# Altium schematic sheet Real Time Clock.SchDoc: Real Time Clock
size OrCAD A; DocumentNumber: LM-003; Revision: 3.0; SheetNumber: 8; SheetTotal: 11
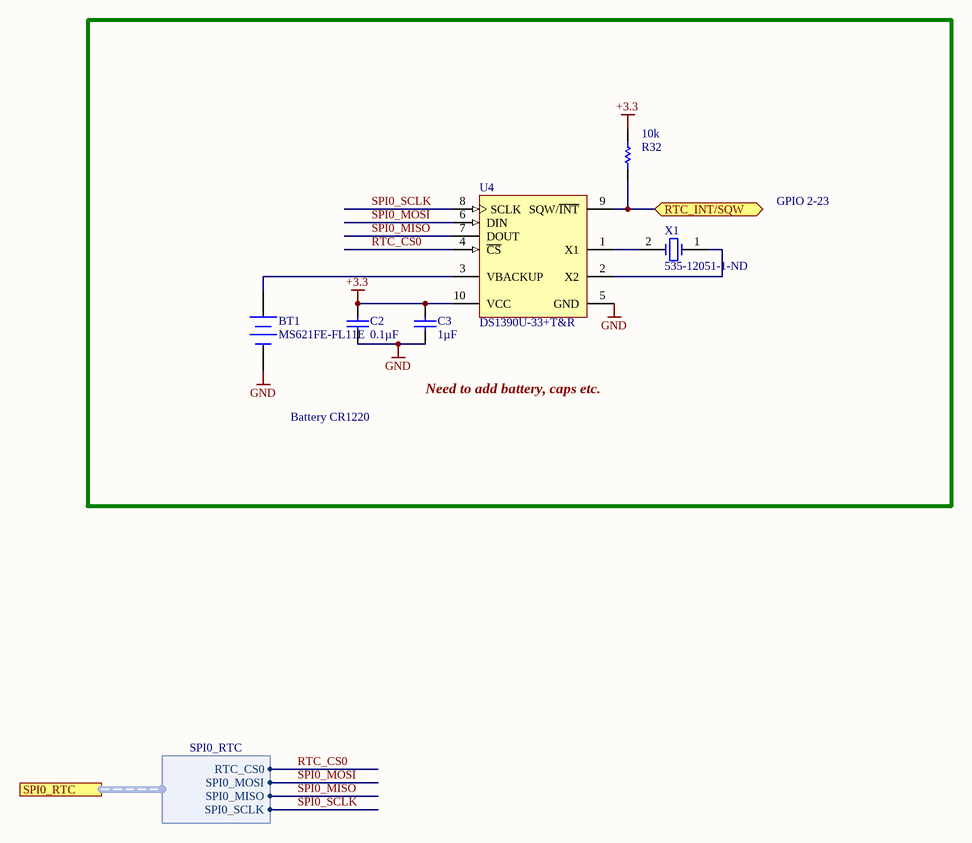
[diagram p0: Real Time Clock.SchDoc]

## Parts
BT1  MS621FE-FL11E  [SEIK-MS621FE-FL11E-2_V]
C2  Capacitance: 0.1µF  [CAPC0805(2012)100_N]  (hidden comment: CAP 100nF 25V 0805(2012))
C3  Capacitance: 1µF  [CAPC0805(2012)100_M]  (hidden comment: CAP 1uF 25V 0805(2012))
R32  Resistance (Ohms): 10k  [RESC0805(2012)_N]  (hidden comment: RES SMD TBD OHM 1% 1/8W 0805)
U4  DS1390U-33+T&R  [U10+2_L]
X1  Supplier Part Number 1: 535-12051-1-ND  [AB26TRQ-32.768KHZ-T]  (hidden comment: AB26TRQ-32.768KHZ-T)

## Ports
RTC_INT/SQW, SPI0_RTC (harness SPI0_RTC)

## Harnesses
SPI0_RTC: RTC_CS0, SPI0_MOSI, SPI0_MISO, SPI0_SCLK

## Nets
+3.3: C2.2 C3.2 R32.1 U4.10(VCC)
GND: BT1.2(-) C2.1 C3.1 U4.5(GND)
RTC_CS0: U4.4(~{CS}) ; port SPI0_RTC.RTC_CS0
RTC_INT/SQW: R32.2 U4.9(SQW/~{INT}) ; port RTC_INT/SQW
SPI0_MISO: U4.7(DOUT) ; port SPI0_RTC.SPI0_MISO
SPI0_MOSI: U4.6(DIN) ; port SPI0_RTC.SPI0_MOSI
SPI0_SCLK: U4.8(SCLK) ; port SPI0_RTC.SPI0_SCLK
NetBT1_1: BT1.1(+) U4.3(VBACKUP)
NetU4_1: U4.1(X1) X1.2
NetU4_2: U4.2(X2) X1.1

## Notes on the sheet
- GPIO 2-23
- Battery CR1220
- Need to add battery, caps etc.
- Title
- Size:
- Date:
- Orcad A
- Number:
- Time:
- Revision:
- Sheet
- of
- ZLS Corporation
- 7801 North Lamar Blvd
- Suite E-184
- Austin, TX  78752
- Phone: (512) 453-0288
- File:

## Library data of the parts
BT1 = CMP-2000-05342-1: MS Lihium Rechargeable Battery, 3 V, -20 to 60 degC, Tray; Manufacturer: SeikoInstruments; Brand: SeikoInstrumentsMicroEnergy; Output Voltage: 3V; Capacity: 5.5mAh; Chemistry: Lithium; Battery Size: 621; Unit Weight: 0.008113oz; Datasheet URL: http://datasheet.octopart.com/MS621FE-FL11E-Seiko-datasheet-5320152.pdf; Rechargeable/Non-Rechargeable: Rechargeable; Orientation: Vertical; Height: 2.1mm; Series: MS; Datasheet Version: Jan-08; Type: CoinCellBatterywithLeads; Diameter: 6.8mm; Mounting Style: WithLeads; Product Category: CoinCellBattery; Termination Style: ThroughHole; Packaging: Tray; Manufacturer URL: http://www.sii.co.jp/en/; RoHS: NotApplicable; Factory Pack Quantity: 100
C2 = CMP-1036-04416-1: CAP 100nF 25V -20% to +80% 0805 (2012 Metric) Thickness 1mm SMD; Manufacturer: Murata Electronics North America; Manufacturer Part Number: GRM21BR71E104KA01L; Tolerance: ±10%; Temperature Coefficient: X7R; Supplier 1: Digi-Key; Supplier Part Number 1: 490-1673-1-ND; RoHS: RoHS Compliant; Category: Capacitors; Stock 1: 895391; Pricing 1: 1=0.2, 10=0.145, 100=0.0683, 500=0.04788, 1000=0.03964 (USD); Packaging: Cut Tape (CT); Part Status: Active; Voltage - Rated: 25V; Operating Temperature: -55°C ~ 125°C; Features: -; Ratings: -; Applications: General Purpose; Mounting Type: Surface Mount, MLCC; Package / Case: 0805 (2012 Metric); Size / Dimension: 0.079" L x 0.049" W (2.00mm x 1.25mm); Height - Seated (Max): -; Thickness (Max): 0.053" (1.35mm); Lead Spacing: -; Lead Style: -; ComponentLink1URL: http://www.murata.com/~/media/webrenewal/support/library/catalog/products/capacitor/mlcc/c02e.ashx; ComponentLink1Description: http://www.murata.com/~/media/webrenewal/support/library/catalog/products/capacitor/mlcc/c02e.ashx
C3 = CMP-1036-04754-1: CAP 1uF 25V ±10% 0805 (2012 Metric) Thickness 1mm SMD; Manufacturer: Murata Electronics North America; Manufacturer Part Number: GRM21BR71E105KA99L; Temperature Coefficient: X7R; Supplier 1: Digi-Key; Supplier Part Number 1: 490-6484-1-ND; RoHS: RoHS Compliant; Category: Capacitors; Stock 1: 295334; Pricing 1: 1=0.14, 10=0.099, 100=0.0468, 1000=0.02715 (USD); Packaging: Cut Tape (CT); Part Status: Active; Tolerance: ±10%; Voltage - Rated: 25V; Operating Temperature: -55°C ~ 125°C; Features: -; Ratings: -; Applications: General Purpose; Mounting Type: Surface Mount, MLCC; Package / Case: 0805 (2012 Metric); Size / Dimension: 0.079" L x 0.049" W (2.00mm x 1.25mm); Height - Seated (Max): -; Thickness (Max): 0.053" (1.35mm); Lead Spacing: -; Lead Style: -; ComponentLink1URL: http://www.murata.com/~/media/webrenewal/support/library/catalog/products/capacitor/mlcc/c02e.ashx; ComponentLink1Description: http://www.murata.com/~/media/webrenewal/support/library/catalog/products/capacitor/mlcc/c02e.ashx
R32 = CMP-1013-00393-1
U4 = CMP-0254-00498-1: SPI Real-Time Clock with Trickle Charger, 3.3V, 10-Pin uSOP, -40 to 85 degC, Pb-Free, Reel; PackageDescription: 10-Pin Micro-MAX Thin Shrink Small Outline (uSOP), 3 x 3 x 0.85 mm Body, 0.5 mm Pitch, Pb-Free; PackageReference: U10+2; ComponentLink3Description: Package Specification; ComponentLink1URL: http://www.maxim-ic.com; Code_JEDEC: MO-187-BA; ComponentLink3URL: http://pdfserv.maxim-ic.com/package_dwgs/21-0061.PDF; PackageVersion: revL, 2008; DatasheetVersion: rev3, Aug-2009; ComponentLink2Description: Datasheet; ComponentLink1Description: Manufacturer URL; ComponentLink2URL: http://datasheets.maxim-ic.com/en/ds/DS1390-DS1394.pdf
X1 = AB26TRQ-32.768KHZ-T: Supplier 1: Digi-Key